# Altium project LM-CT-Full-Feedback-001.PrjPcb
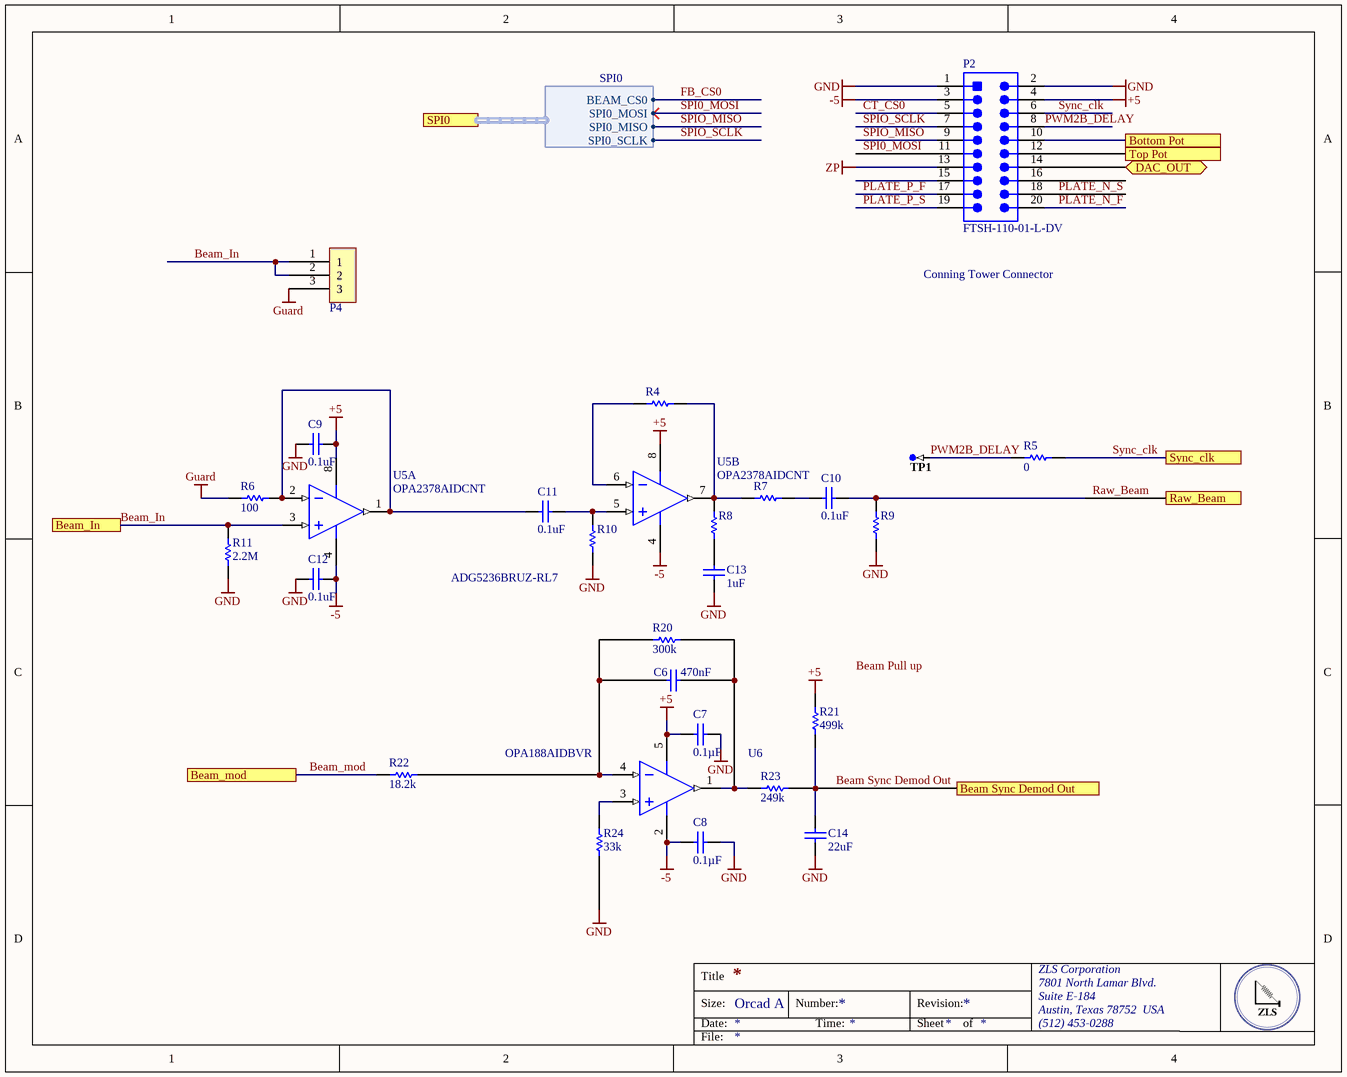
[diagram p0: Synch_Demod.SchDoc]
4 sheets, 79 parts. Net scope: flat (ports and power ports of the same name join across sheets).
Board file: LM-CT-001.PcbDoc
Sheets:
  Synch_Demod.SchDoc
  ADC.SchDoc
  Sense_Plates.SchDoc
  ZP_Force_Plates.SchDoc

## Sheet Synch_Demod.SchDoc
size OrCAD A

### Parts
C6  470nF  [CAPC0805(2012)75_L]
C7  Capacitance: 0.1µF  [CAPC0805(2012)145_N]  (hidden comment: CAP CER 0.1UF 25V X7R 0805)
C8  Capacitance: 0.1µF  [CAPC0805(2012)145_N]  (hidden comment: CAP CER 0.1UF 25V X7R 0805)
C9  0.1uF  [CAPC0402(1005)60_L]
C10  0.1uF  [CAPC0402(1005)60_L]
C11  0.1uF  [CAPC0402(1005)60_L]
C12  0.1uF  [CAPC0402(1005)60_L]
C13  1uF  [CAPC0402(1005)60_L]
C14  22uF  [CAPC0805(2012)75_L]
P2  FTSH-110-01-L-DV  [SMTC-FTSH-110-01-L-DV_V]
P4  Triax_Conn  [Triax_Conn]  (value not drawn)
R4  (no value)  [RESC0402(1005)_M]
R5  0  [RESC0402(1005)_M]
R6  100  [RESC0402(1005)_M]
R7  (no value)  [RESC0402(1005)_M]
R8  (no value)  [RESC0402(1005)_M]
R9  (no value)  [RESC0402(1005)_M]
R10  (no value)  [RESC0402(1005)_M]
R11  2.2M  [RESC0402(1005)_M]
R20  300k  [RESC0402(1005)_M]
R21  499k  [RESC0402(1005)_M]
R22  18.2k  [RESC0402(1005)_M]
R23  249k  [RESC0402(1005)_M]
R24  33k  [RESC0402(1005)_M]
TP1  TP-SM-C-100  [TP-SM-C-100]  (value not drawn)  (no BOM)
U5  OPA2378AIDCNT  [DCN0008A_M]  (parts A,B of 2)
U6  OPA188AIDBVR  [DBV0005A_M]

### Ports
Beam Sync Demod Out, Beam_In, Beam_mod, Bottom Pot, DAC_OUT, Raw_Beam, SPI0 (harness SPI0), Sync_clk, Top Pot

### Harnesses
SPI0: BEAM_CS0, SPI0_MOSI, SPI0_MISO, SPI0_SCLK

### Nets
+5: C7.1 C9.2 P2.4 R21.1 U5.8(V+) U6.5(V+)
-5: C8.1 C12.2 P2.3 U5.4(V-) U6.2(V-)
GND: C7.2 C8.2 C9.1 C12.1 C13.1 C14.1 P2.1 P2.2 R9.2 R10.2 R11.1 R24.2
Guard: P4.3 R6.2
ZP: P2.13
Beam Sync Demod Out: C14.2 R21.2 R23.2 ; port Beam Sync Demod Out
Beam_In: P4.1 P4.2 R11.2 U5.3(IN_A+) ; port Beam_In
Beam_mod: R22.1 ; port Beam_mod
CT_CS0: P2.5
DAC_OUT: P2.14 ; port DAC_OUT
PLATE_N_F: P2.20
PLATE_N_S: P2.18
PLATE_P_F: P2.17
PLATE_P_S: P2.19
PWM2B_DELAY: P2.8 R5.1 TP1.1
Raw_Beam: C10.2 R9.1 ; port Raw_Beam
SPI0_MOSI: P2.11 ; port SPI0.SPI0_MOSI
SPIO_MISO: P2.9 ; port SPI0.SPI0_MISO  [project net SPI0_MISO]
SPIO_SCLK: P2.7 ; port SPI0.SPI0_SCLK  [project net SPI0_SCLK]
Sync_clk: P2.6 R5.2 ; port Sync_clk
NetC6_1: C6.1 R20.1 R22.2 U6.4(IN-)
NetC6_2: C6.2 R20.2 R23.1 U6.1(OUT)
NetC10_1: C10.1 R7.1
NetC11_1: C11.1 R6.1 U5.1(OUT_A) U5.2(IN_A-)
NetC11_2: C11.2 R10.1 U5.5(IN_B+)
NetC13_2: C13.2 R8.2
NetP2_10: P2.10 ; port Bottom Pot
NetP2_12: P2.12 ; port Top Pot
NetR4_1: R4.1 R7.2 R8.1 U5.7(OUT_B)
NetR4_2: R4.2 U5.6(IN_B-)
NetR24_1: R24.1 U6.3(IN+)

Not connected (* = marked no-connect by the designer): P2 15 16

### Notes on the sheet
- Conning Tower Connector
- ADG5236BRUZ-RL7
- Labels drawn without touching a wire or pin: Beam Pull up
- Title
- Size:
- Date:
- Orcad A
- Number:
- Time:
- Revision:
- Sheet
- of
- ZLS Corporation
- 7801 North Lamar Blvd.
- Suite E-184
- Austin, Texas 78752  USA
- (512) 453-0288
- File:

### Library data of the parts
C6 = CMP-1036-02117-1: CAP CER 0.47UF 25V X7R 0805; Manufacturer: Murata Electronics North America; Manufacturer Part Number: GRM219R71E474KA88D; Tolerance: ±10%; Supplier 1: Digi-Key; Supplier Part Number 1: 490-11584-1-ND; RoHS: RoHS Compliant; Category: Capacitors; Stock 1: 410; Pricing 1: 1=0.38, 10=0.262, 100=0.1573, 500=0.118, 1000=0.09964 (USD); Packaging: Cut Tape (CT); Part Status: Active; Voltage - Rated: 25V; Temperature Coefficient: X7R; Operating Temperature: -55°C ~ 125°C; Features: -; Ratings: -; Applications: General Purpose; Mounting Type: Surface Mount, MLCC; Package / Case: 0805 (2012 Metric); Size / Dimension: 0.079" L x 0.049" W (2.00mm x 1.25mm); Height - Seated (Max): -; Thickness (Max): 0.037" (0.95mm); Lead Spacing: -; Lead Style: -; ComponentLink1URL: https://www.murata.com/~/media/webrenewal/support/library/catalog/products/capacitor/mlcc/c02e.ashx?la=en-us; ComponentLink1Description: https://www.murata.com/~/media/webrenewal/support/library/catalog/products/capacitor/mlcc/c02e.ashx?la=en-us
C7 C8 = CMP-1036-04795-1: Manufacturer: Murata Electronics North America; Manufacturer Part Number: GRM21BR71E104KA01L; Tolerance: ±10%; Supplier 1: Digi-Key; Supplier Part Number 1: 490-1673-6-ND; RoHS: RoHS Compliant; Category: Capacitors; Stock 1: 891652; Pricing 1: 1=0.2, 10=0.145, 100=0.0683, 500=0.04788, 1000=0.03964 (USD); Packaging: Digi-Reel®; Part Status: Active; Voltage - Rated: 25V; Temperature Coefficient: X7R; Operating Temperature: -55°C ~ 125°C; Features: -; Ratings: -; Applications: General Purpose; Mounting Type: Surface Mount, MLCC; Package / Case: 0805 (2012 Metric); Size / Dimension: 0.079" L x 0.049" W (2.00mm x 1.25mm); Height - Seated (Max): -; Thickness (Max): 0.053" (1.35mm); Lead Spacing: -; Lead Style: -; ComponentLink1URL: http://www.murata.com/~/media/webrenewal/support/library/catalog/products/capacitor/mlcc/c02e.ashx; ComponentLink1Description: http://www.murata.com/~/media/webrenewal/support/library/catalog/products/capacitor/mlcc/c02e.ashx
C9-C13 = CMP-1034-00252-1: CAP CER 0.1UF 10V X7R 0402; Manufacturer: Murata Electronics North America; Manufacturer Part Number: GRM155R71A104KA01D; Tolerance: ±10%; Supplier 1: Digi-Key; Supplier Part Number 1: 490-6321-1-ND; RoHS: RoHS Compliant; Category: Capacitors; Stock 1: 2920395; Pricing 1: 1=0.1, 10=0.014, 100=0.0063, 500=0.00446, 1000=0.00351, 2500=0.00319, 5000=0.00293 (USD); Packaging: Cut Tape (CT); Part Status: Active; Voltage - Rated: 10V; Temperature Coefficient: X7R; Operating Temperature: -55°C ~ 125°C; Features: -; Ratings: -; Applications: General Purpose; Mounting Type: Surface Mount, MLCC; Package / Case: 0402 (1005 Metric); Size / Dimension: 0.039" L x 0.020" W (1.00mm x 0.50mm); Height - Seated (Max): -; Thickness (Max): 0.022" (0.55mm); Lead Spacing: -; ComponentLink1URL: http://www.murata.com/~/media/webrenewal/support/library/catalog/products/capacitor/mlcc/c02e.ashx?la=en-us; ComponentLink1Description: http://www.murata.com/~/media/webrenewal/support/library/catalog/products/capacitor/mlcc/c02e.ashx?la=en-us
C14 = CMP-1036-02117-1: CAP CER 22UF 25V X5R 0805; Manufacturer: Murata Electronics North America; Manufacturer Part Number: GRM21BR61E226ME44L; Tolerance: ±20%; Notification: Current market demand for these product types have resulted in fluctuating and extending lead times. Lead times may differ.; Supplier 1: Digi-Key; Supplier Part Number 1: 490-10749-1-ND; RoHS: RoHS Compliant; Category: Capacitors; Stock 1: 2004; Pricing 1: 1=0.57, 10=0.404, 100=0.2663, 500=0.19722, 1000=0.16764 (USD); Packaging: Cut Tape (CT); Part Status: Active; Voltage - Rated: 25V; Temperature Coefficient: X5R; Operating Temperature: -55°C ~ 85°C; Features: -; Ratings: -; Applications: General Purpose; Mounting Type: Surface Mount, MLCC; Package / Case: 0805 (2012 Metric); Size / Dimension: 0.079" L x 0.049" W (2.00mm x 1.25mm); Height - Seated (Max): -; Thickness (Max): 0.057" (1.45mm); Lead Spacing: -; Lead Style: -; ComponentLink1URL: http://search.murata.co.jp/Ceramy/image/img/A01X/G101/ENG/GRM21BR61E226ME44-01.pdf; ComponentLink1Description: http://search.murata.co.jp/Ceramy/image/img/A01X/G101/ENG/GRM21BR61E226ME44-01.pdf
P2 = CMP-2000-06294-2: Male Header, Pitch 1.27 mm, 2 x 10 Position, Height 6.1 mm, -55 to 125 degC, RoHS, Tube; Manufacturer: Samtec; Online Catalog: FTSHSeries; Number of Positions Loaded: All; Connector Type: Header,Unshrouded; Product Training Modules: Board-to-BoardConnectors; Featured Product: Board-To-BoardInterconnectSystems; Other Names: SAM1161-10; EDA / CAD Models: DownloadfromAcceleratedDesigns; Number of Positions: 20; Catalog Drawings: FTSHSeriesFTSHSeriesSMTSide; Package Reference: FTSH-110-01-L-DV; Family: RectangularConnectors-Headers,MalePins; Mounting Technology: SurfaceMount; Contact Type: MalePin; Manufacturer URL: http://www.samtec.com/; Package URL: http://suddendocs.samtec.com/prints/ftsh-1xx-xx-xxx-dv-xxx-xxx-mkt.pdf; Package Description: Male Header, Pitch 1.27 mm, 2 x 10 Position, Height 6.1 mm; Packaging: Bulk; Termination: Solder; Category: Connectors,Interconnects; Fastening Type: -; Datasheet Version: F-215 , 02/2016; Contact Finish Thickness: 10µin(0.25µm); Number of Rows: 2; Datasheet URL: http://suddendocs.samtec.com/catalog_english/ftsh_smt.pdf; Mounting Type: SurfaceMount; Series: FTSH; Features: -; Contact Finish: Gold; Standard Package: 1; Color: Black
R4-R11 R20-R24 = CMP-1011-00463-1
TP1 = CMP-0484-00002-2: Test Point, Surface Mount, Circular, Pad Diameter 1 mm; Manufacturer: No Vendor; PartNumber: TP-SM-C-100
U5 = CMP-0272-01124-3: Low-Noise, 900 kHz, RRIO, Precision Operational Amplifier, Zero-Drift Series, 2.2 to 5.5 V, -40 to 125 degC, 8-pin SOP (DCN8), Green (RoHS & no Sb/Br); Manufacturer: Texas Instruments; Number of Channels: 2; Offset Drift(Typ)(uV/C): 0.25; Total Supply Voltage(Min)(+5V is 5, +/-5V is 10): 2.2; Vn at 1kHz(Typ)(nV/rtHz): 20; Iq per channel(Max)(mA): 0.15; Total Supply Voltage(Max)(+5V is 5, +/-5V is 10): 5.5; Sub Family: Low Offset Voltage Amplifier (<=500uV), Low Power Amp (<=500uA), Low Supply Voltage Amplifier (<=2.7V), Precision Amplifier, Zero Drift Precision Amplifier; IIB(Max)(pA): 550; Vio (25C)(Max)(mV): 0.07; CMRR(Min)(dB): 100; Slew Rate(Typ)(V/us): 0.4; PartNumber: OPA2378AIDCNT; DatasheetVersion: SBOS417D; ComponentLink2Description: Datasheet; ComponentLink3URL: http://www.ti.com/lit/ml/mpds099c/mpds099c.pdf; ComponentLink2URL: http://www.ti.com/general/docs/lit/getliterature.tsp?genericPartNumber=OPA2378&fileType=pdf; PackageReference: DCN0008A; PackageDescription: 8-Pin Plastic Small Outline, Body 1.6 x 2.9 mm, Pitch 0.65 mm; Code_JEDEC: MO-178; PackageVersion: 4202106/D, 11/2009; ComponentLink3Description: Package Specification; Eco-Plan: Green (RoHS & no Sb/Br); ComponentLink1Description: Manufacturer URL; Mounting Technology: Surface Mount; ComponentLink1URL: http://www.ti.com/; PartId: 1
U6 = CMP-0809-00005-2: Precision, Low Noise, Rail-to-Rail Output, Zero-Drift Operational Amplifier, 4 to 36 V, -40 to 125 degC, 5-pin SOT23 (DBV5), Green (RoHS & no Sb/Br); Manufacturer: Texas Instruments; Total Supply Voltage(Min)(+5V is 5, +/-5V is 10): 4; Offset Drift(Typ)(uV/C): 0.03; Rating: Catalog; SubFamily: Zero Drift Precision Amplifier; GBW(Typ)(MHz): 2; Slew Rate(Typ)(V/us): 0.8; Number of Channels: 1; CMRR(Min)(dB): 120; Iq per channel(Max)(mA): 0.51; Total Supply Voltage(Max)(+5V is 5, +/-5V is 10): 36; PartNumber: OPA188AIDBVR; ComponentLink2Description: Datasheet; ComponentLink2URL: http://www.ti.com/lit/ds/symlink/opa188.pdf; ComponentLink1Description: Manufacturer URL; Mounting Technology: Surface Mount; Eco-Plan: Green (RoHS & no Sb/Br); ComponentLink1URL: http://www.ti.com/; PackageVersion: 4073253-4/K, 03/2006; DatasheetVersion: SBOS642A; ComponentLink3Description: Package Specification; PackageReference: DBV0005A; ComponentLink3URL: http://www.ti.com/litv/pdf/mpds018i; PackageDescription: 5-Pin Plastic Small Outline, Body 1.6 x 2.9 mm, Pitch 0.95 mm; Code_JEDEC: MO-178

## Sheet ADC.SchDoc
size OrCAD A
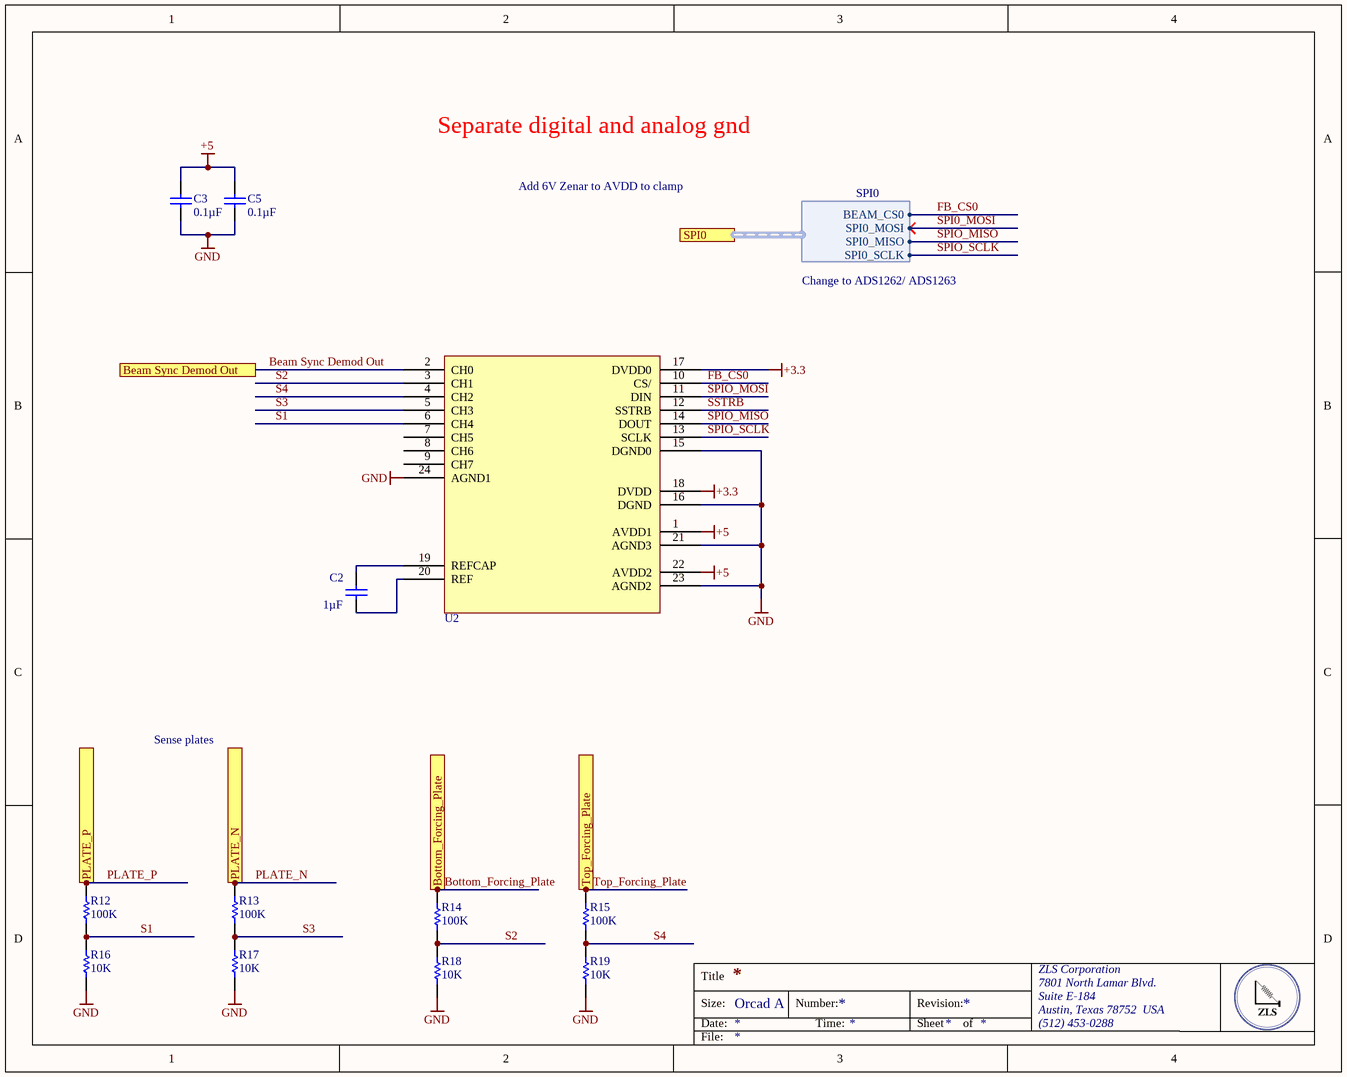
[diagram p1: ADC.SchDoc]

### Parts
C2  Capacitance: 1µF  [CAPC0805(2012)145_N]  (hidden comment: CAP CER 0.1UF 25V X7R 0805)
C3  Capacitance: 0.1µF  [CAPC0805(2012)145_N]  (hidden comment: CAP CER 0.1UF 25V X7R 0805)
C5  Capacitance: 0.1µF  [CAPC0805(2012)145_N]  (hidden comment: CAP CER 0.1UF 25V X7R 0805)
R12  100K  [RESC0402(1005)_M]
R13  100K  [RESC0402(1005)_M]
R14  100K  [RESC0402(1005)_M]
R15  100K  [RESC0402(1005)_M]
R16  10K  [RESC0402(1005)_M]
R17  10K  [RESC0402(1005)_M]
R18  10K  [RESC0402(1005)_M]
R19  10K  [RESC0402(1005)_M]
U2  MAX1300  [MAX1300]  (value not drawn)

### Ports
Beam Sync Demod Out, Bottom_Forcing_Plate, PLATE_N, PLATE_P, SPI0 (harness SPI0), Top_Forcing_Plate

### Harnesses
SPI0: BEAM_CS0, SPI0_MOSI, SPI0_MISO, SPI0_SCLK

### Nets
+3.3: U2.17(DVDD0) U2.18(DVDD)
+5: C3.2 C5.2 U2.1(AVDD1) U2.22(AVDD2)
GND: C3.1 C5.1 R16.1 R17.1 R18.1 R19.1 U2.15(DGND0) U2.16(DGND) U2.21(AGND3) U2.23(AGND2) U2.24(AGND1)
Beam Sync Demod Out: U2.2(CH0) ; port Beam Sync Demod Out
Bottom_Forcing_Plate: R14.2 ; port Bottom_Forcing_Plate  [project net Bottom Forcing Plate Force]
FB_CS0: U2.10(CS/) ; port SPI0.BEAM_CS0
PLATE_N: R13.2 ; port PLATE_N
PLATE_P: R12.2 ; port PLATE_P
S1: R12.1 R16.2 U2.6(CH4)
S2: R14.1 R18.2 U2.3(CH1)
S3: R13.1 R17.2 U2.5(CH3)
S4: R15.1 R19.2 U2.4(CH2)
SPIO_MISO: U2.14(DOUT) ; port SPI0.SPI0_MISO  [project net SPI0_MISO]
SPIO_MOSI: U2.11(DIN)
SPIO_SCLK: U2.13(SCLK) ; port SPI0.SPI0_SCLK  [project net SPI0_SCLK]
SSTRB: U2.12(SSTRB)
Top_Forcing_Plate: R15.2 ; port Top_Forcing_Plate  [project net Top Forcing Plate Sense]
NetC2_1: C2.1 U2.19(REFCAP)
NetC2_2: C2.2 U2.20(REF)

Not connected (* = marked no-connect by the designer): U2 7(CH5) 8(CH6) 9(CH7)

### Notes on the sheet
- Separate digital and analog gnd
- Add 6V Zenar to AVDD to clamp
- Change to ADS1262/ ADS1263
- Sense plates
- Title
- Size:
- Date:
- Orcad A
- Number:
- Time:
- Revision:
- Sheet
- of
- ZLS Corporation
- 7801 North Lamar Blvd.
- Suite E-184
- Austin, Texas 78752  USA
- (512) 453-0288
- File:

### Library data of the parts
C2 C3 C5 = CMP-1036-04795-1: as C7 on sheet Synch_Demod; Supplier 1: Digi-Key; Supplier Part Number 1: 490-1673-6-ND; RoHS: RoHS Compliant; Category: Capacitors; Stock 1: 891652; Pricing 1: 1=0.2, 10=0.145, 100=0.0683, 500=0.04788, 1000=0.03964 (USD); Packaging: Digi-Reel®; Part Status: Active; Voltage - Rated: 25V; Temperature Coefficient: X7R; Operating Temperature: -55°C ~ 125°C; Features: -; Ratings: -; Applications: General Purpose; Mounting Type: Surface Mount, MLCC; Package / Case: 0805 (2012 Metric); Size / Dimension: 0.079" L x 0.049" W (2.00mm x 1.25mm); Height - Seated (Max): -; Thickness (Max): 0.053" (1.35mm); Lead Spacing: -; Lead Style: -; ComponentLink1URL: http://www.murata.com/~/media/webrenewal/support/library/catalog/products/capacitor/mlcc/c02e.ashx; ComponentLink1Description: http://www.murata.com/~/media/webrenewal/support/library/catalog/products/capacitor/mlcc/c02e.ashx
R12-R19 = CMP-1011-00463-1

## Sheet Sense_Plates.SchDoc
size Tabloid; Organization: Altium Limited; Address1: L3, 12a Rodborough Rd; Address2: Frenchs Forest; Address3: NSW; Address4: Australia 2086
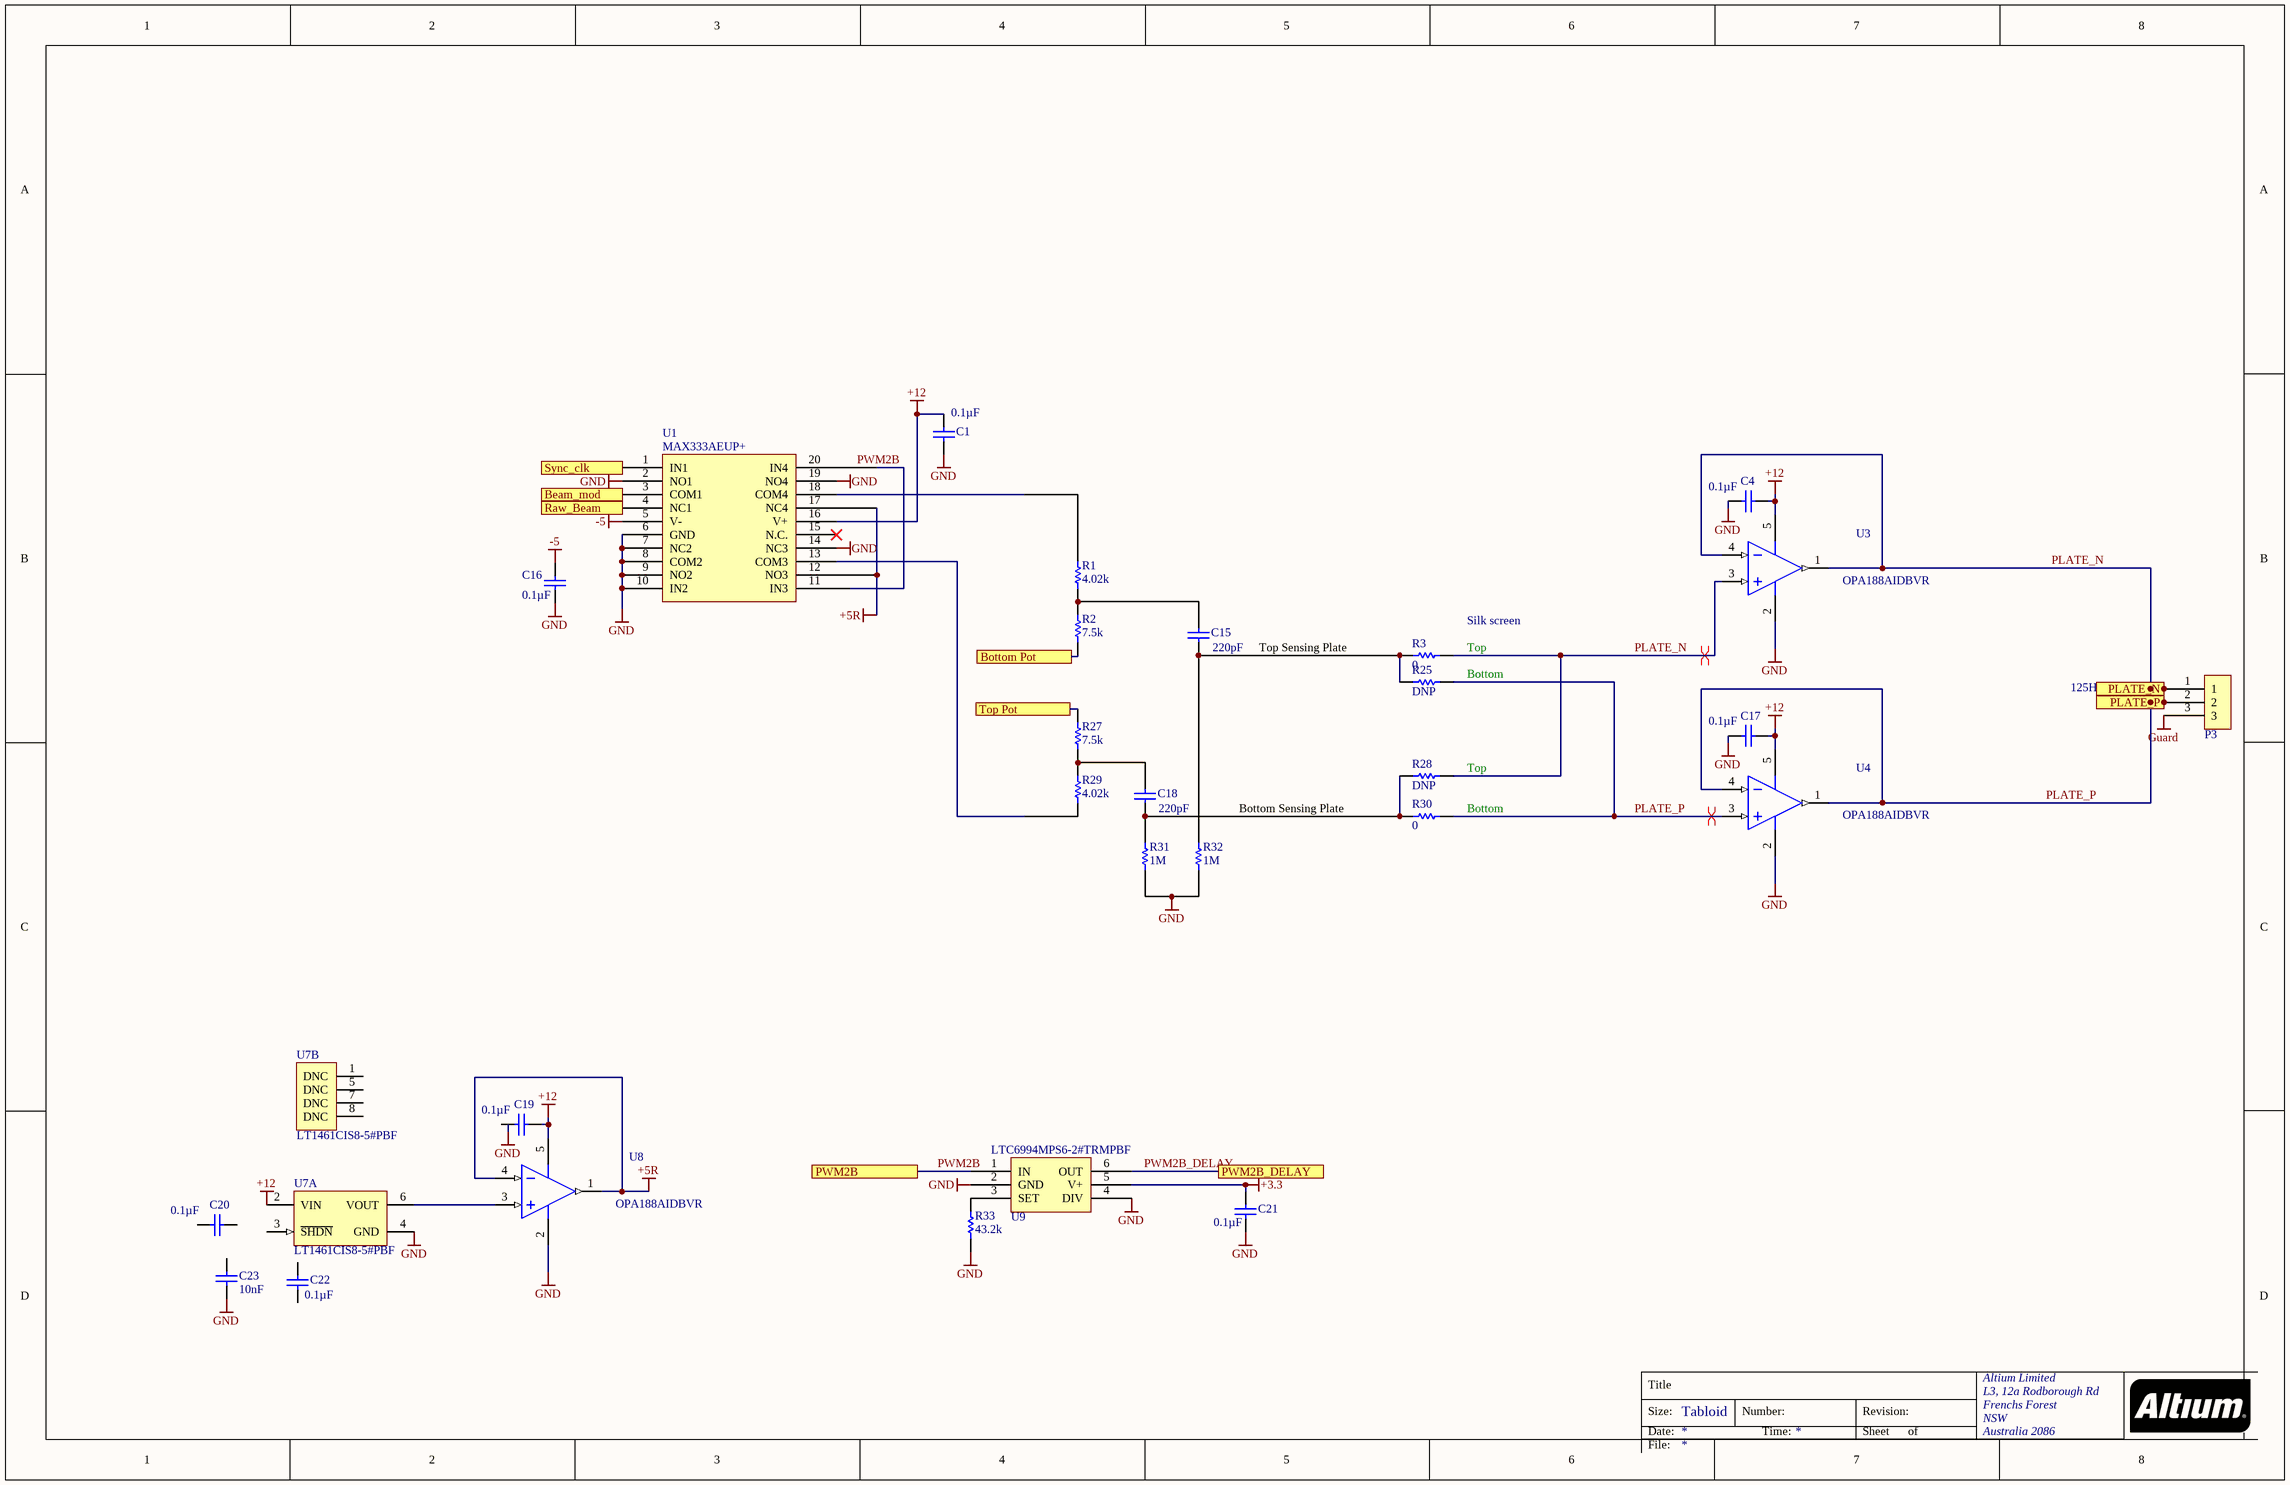
[diagram p2: Sense_Plates.SchDoc]

### Parts
C1  Capacitance: 0.1µF  [CAPC0805(2012)145_N]  (hidden comment: CAP CER 0.1UF 25V X7R 0805)
C4  Capacitance: 0.1µF  [CAPC0805(2012)145_N]  (hidden comment: CAP CER 0.1UF 25V X7R 0805)
C15  Capacitance: 220pF  [CAPC0805(2012)155_L]  (hidden comment: CAP CER 1UF 25V X7R 0805)
C16  Capacitance: 0.1µF  [CAPC0805(2012)145_N]  (hidden comment: CAP CER 0.1UF 25V X7R 0805)
C17  Capacitance: 0.1µF  [CAPC0805(2012)145_N]  (hidden comment: CAP CER 0.1UF 25V X7R 0805)
C18  Capacitance: 220pF  [CAPC0805(2012)155_L]  (hidden comment: CAP CER 1UF 25V X7R 0805)
C19  Capacitance: 0.1µF  [CAPC0805(2012)145_N]  (hidden comment: CAP CER 0.1UF 25V X7R 0805)
C20  Capacitance: 0.1µF  [CAPC0805(2012)145_N]  (hidden comment: CAP CER 0.1UF 25V X7R 0805)
C21  Capacitance: 0.1µF  [CAPC0805(2012)145_N]  (hidden comment: CAP CER 0.1UF 25V X7R 0805)
C22  Capacitance: 0.1µF  [CAPC0805(2012)145_N]  (hidden comment: CAP CER 0.1UF 25V X7R 0805)
C23  Capacitance: 10nF  [CAPC0805(2012)145_N]  (hidden comment: Multilayer Ceramic Capacitors MLCC - SMD/SMT 0.01uF 50volts 10% X7R)
P3  Triax_Conn  [Triax_Conn]  (value not drawn)
R1  4.02k  [RESC0402(1005)_M]
R2  7.5k  [RESC0402(1005)_M]
R3  0  [RESC0402(1005)_M]
R25  DNP  [RESC0402(1005)_M]
R27  7.5k  [RESC0402(1005)_M]
R28  DNP  [RESC0402(1005)_M]
R29  4.02k  [RESC0402(1005)_M]
R30  0  [RESC0402(1005)_M]
R31  1M  [RESC0402(1005)_M]
R32  1M  [RESC0402(1005)_M]
R33  43.2k  [RESC0402(1005)_M]
U1  MAX333AEUP+  [TSOP65P640X90-20N]
U3  OPA188AIDBVR  [DBV0005A_M]
U4  OPA188AIDBVR  [DBV0005A_M]
U7  LT1461CIS8-5#PBF  [LT-S8-8_L]  (parts A,B of 2)
U8  OPA188AIDBVR  [DBV0005A_M]
U9  LTC6994MPS6-2#TRMPBF  [LTC6994MPS6-2#TRMPBF]

### Ports
Beam_mod, Bottom Pot, PLATE_N, PLATE_P, PWM2B, PWM2B_DELAY, Raw_Beam, Sync_clk, Top Pot

### Nets
+3.3: C21.1 U9.5(V+)
+5R: U1.12(NO3) U1.17(NC4) U8.1(OUT) U8.4(IN-)
+12: C1.1 C4.2 C17.2 C19.2 U1.16(V+) U3.5(V+) U4.5(V+) U7.2(VIN) U8.5(V+)
-5: C16.1 U1.5(V-)
GND: C1.2 C4.1 C16.2 C17.1 C21.2 C23.2 R31.1 R32.1 R33.1 U1.2(NO1) U1.6(GND) U1.7(NC2) U1.8(COM2) U1.9(NO2) U1.10(IN2) U1.14(NC3) U1.19(NO4) U3.2(V-) U4.2(V-) U7.4(GND) U8.2(V-) U9.2(GND) U9.4(DIV)
Guard: P3.3
Beam_mod: U1.3(COM1) ; port Beam_mod
PLATE_N: P3.1 R3.1 R28.1 U3.1(OUT) U3.3(IN+) U3.4(IN-) ; port PLATE_N
PLATE_P: P3.2 R25.1 R30.1 U4.1(OUT) U4.3(IN+) U4.4(IN-) ; port PLATE_P
PWM2B: U1.11(IN3) U1.20(IN4) U9.1(IN) ; port PWM2B
PWM2B_DELAY: U9.6(OUT) ; port PWM2B_DELAY
Raw_Beam: U1.4(NC1) ; port Raw_Beam
Sync_clk: U1.1(IN1) ; port Sync_clk
NetC15_1: C15.1 R3.2 R25.2 R32.2
NetC15_2: C15.2 R1.1 R2.2
NetC18_1: C18.1 R28.2 R30.2 R31.2
NetC18_2: C18.2 R27.1 R29.2
NetP2_10: R2.1 ; port Bottom Pot
NetP2_12: R27.2 ; port Top Pot
NetR1_2: R1.2 U1.18(COM4)
NetR29_1: R29.1 U1.13(COM3)
NetR33_2: R33.2 U9.3(SET)
NetU7_6: U7.6(VOUT) U8.3(IN+)

Not connected (* = marked no-connect by the designer): C19 1; C20 1 2; C22 1 2; C23 1; U1 15(N.C.)*; U7 1(DNC) 3(~{SHDN}) 5(DNC) 7(DNC) 8(DNC)

### Layout directives
differential pair: PLATE_N, PLATE_P

### Notes on the sheet
- Silk screen
- Top Sensing Plate
- Top
- Bottom
- 125Hz
- Bottom Sensing Plate
- (near R28) Top
- Title
- Size:
- Date:
- Tabloid
- Number:
- Time:
- Revision:
- Sheet
- of
- File:

### Library data of the parts
C1 C4 C16 C17 C19-C22 = CMP-1036-04795-1: as C7 on sheet Synch_Demod; Supplier 1: Digi-Key; Supplier Part Number 1: 490-1673-6-ND; RoHS: RoHS Compliant; Category: Capacitors; Stock 1: 891652; Pricing 1: 1=0.2, 10=0.145, 100=0.0683, 500=0.04788, 1000=0.03964 (USD); Packaging: Digi-Reel®; Part Status: Active; Voltage - Rated: 25V; Temperature Coefficient: X7R; Operating Temperature: -55°C ~ 125°C; Features: -; Ratings: -; Applications: General Purpose; Mounting Type: Surface Mount, MLCC; Package / Case: 0805 (2012 Metric); Size / Dimension: 0.079" L x 0.049" W (2.00mm x 1.25mm); Height - Seated (Max): -; Thickness (Max): 0.053" (1.35mm); Lead Spacing: -; Lead Style: -; ComponentLink1URL: http://www.murata.com/~/media/webrenewal/support/library/catalog/products/capacitor/mlcc/c02e.ashx; ComponentLink1Description: http://www.murata.com/~/media/webrenewal/support/library/catalog/products/capacitor/mlcc/c02e.ashx
C15 C18 = CMP-1036-04882-1: Manufacturer: Murata Electronics North America; Manufacturer Part Number: GRM21BR71E105KA99L; Tolerance: ±10%; Supplier 1: Digi-Key; Supplier Part Number 1: 490-6484-6-ND; RoHS: RoHS Compliant; Category: Capacitors; Stock 1: 295074; Pricing 1: 1=0.14, 10=0.099, 100=0.0468, 500=0.0328, 1000=0.02715 (USD); Packaging: Digi-Reel®; Part Status: Active; Voltage - Rated: 25V; Temperature Coefficient: X7R; Operating Temperature: -55°C ~ 125°C; Features: -; Ratings: -; Applications: General Purpose; Mounting Type: Surface Mount, MLCC; Package / Case: 0805 (2012 Metric); Size / Dimension: 0.079" L x 0.049" W (2.00mm x 1.25mm); Height - Seated (Max): -; Thickness (Max): 0.053" (1.35mm); Lead Spacing: -; Lead Style: -; ComponentLink1URL: http://www.murata.com/~/media/webrenewal/support/library/catalog/products/capacitor/mlcc/c02e.ashx; ComponentLink1Description: http://www.murata.com/~/media/webrenewal/support/library/catalog/products/capacitor/mlcc/c02e.ashx
C23 = CMP-1036-04795-1: Manufacturer: Kemet; Manufacturer Part Number: C0805C103K5RACAUTO; Voltage Rating: 50V; Supplier 1: Digi-Key; Supplier Part Number 1: 399-6924-1-ND; Stock 1: 63236; Pricing 1: 1=0.12, 10=0.087, 100=0.041, 500=0.0287, 1000=0.0238 (USD); Mount: Surface Mount; Case/Package: 0805; Case Code (Metric): 2012; Case Code (Imperial): 0805; Dielectric Material: Ceramic; Contact Plating: Tin; Min Operating Temperature: -55°C; Max Operating Temperature: 125°C; Tolerance: 10%; Packaging: Tape and Reel; Package Quantity: 1; Voltage Rating (DC): 50V; Dielectric: X7R; Termination: SMD/SMT; Length: 2mm; Height: 0.78mm; Width: 0.049inch; Thickness: 0.035inch; Depth: 1.25mm; Radiation Hardening: No; REACH SVHC: No SVHC; ComponentLink1URL: https://datasheet.ciiva.com/22700/1693454-22700519.pdf; ComponentLink1Description: https://datasheet.ciiva.com/22700/1693454-22700519.pdf; ComponentLink2URL: https://datasheet.ciiva.com/7842/1693454-7842175.pdf; ComponentLink2Description: https://datasheet.ciiva.com/7842/1693454-7842175.pdf
R1-R3 R25 R27-R33 = CMP-1011-00463-1
U1 = MAX333CWP+: IC SWITCH QUAD SPDT 20TSSOP; Manufacturer: Maxim Integrated; Multiplexer/Demultiplexer Circuit: 2:1; On-State Resistance (Max): 45 Ohm; Channel-to-Channel Matching (&Delta;Ron): 2 Ohm (Max); Voltage - Supply, Single (V+): 10 V ~ 30 V; Voltage - Supply, Dual (V±): ±4.5 V ~ 20 V; Switch Time (Ton, Toff) (Max): 175ns, 145ns; Charge Injection: 2pC; Channel Capacitance (CS(off), CD(off)): 5pF; Current - Leakage (IS(off)) (Max): 250pA; Crosstalk: -78dB @ 1MHz; Supplier 1: Digi-Key; Supplier Part Number 1: MAX333AEUP+-ND; Manufacturer Part Number: MAX333AEUP+; RoHS: RoHS Compliant; Category: Integrated Circuits (ICs); Stock 1: 1328; Pricing 1: 1=6.77, 10=6.432, 25=6, 50=5.8942 (USD); Packaging: Tube; Part Status: Active; Switch Circuit: SPDT; -3db Bandwidth: -; Operating Temperature: -40°C ~ 85°C (TA); Package / Case: 20-TSSOP (0.173", 4.40mm Width); Supplier Device Package: 20-TSSOP; Base Part Number: MAX333; ComponentLink1URL: https://pdfserv.maximintegrated.com/en/ds/MAX333A.pdf; ComponentLink1Description: https://pdfserv.maximintegrated.com/en/ds/MAX333A.pdf
U3 U4 U8 = CMP-0809-00005-2: as U6 on sheet Synch_Demod; PartNumber: OPA188AIDBVR; ComponentLink2Description: Datasheet; ComponentLink2URL: http://www.ti.com/lit/ds/symlink/opa188.pdf; ComponentLink1Description: Manufacturer URL; Mounting Technology: Surface Mount; Eco-Plan: Green (RoHS & no Sb/Br); ComponentLink1URL: http://www.ti.com/; PackageVersion: 4073253-4/K, 03/2006; DatasheetVersion: SBOS642A; ComponentLink3Description: Package Specification; PackageReference: DBV0005A; ComponentLink3URL: http://www.ti.com/litv/pdf/mpds018i; PackageDescription: 5-Pin Plastic Small Outline, Body 1.6 x 2.9 mm, Pitch 0.95 mm; Code_JEDEC: MO-178
U7 = CMP-2000-06607-1: Micropower Precision Low Dropout Voltage Reference, 5 V, -40 to 85 degC, 8-Pin SOIC, RoHS, Tube; Manufacturer: Linear Technology; Temperature Coefficient: 12ppm/°C; Product Training Modules: VoltageReferenceBasics; Voltage - Output: 5V; Voltage - Input: 5.5V~20V; Package Version: 0; Tolerance: ±0.08%; Current - Quiescent: 50µA; Number of Channels: 1; Current - Output: 100mA; Dynamic Catalog: Series,Fixed-LinearTechnology; Reference Type: Series,Precision; Current - Cathode: -; Standard Package: 100; Supplier Device Package: 8-SOIC; Packaging: Tube; Category: IntegratedCircuits(ICs); Package Reference: S8; Series: -; Family: PMIC-VoltageReference; Datasheet URL: http://cds.linear.com/docs/en/datasheet/1461fb.pdf; Package Description: 8-Pin Plastic Small Outline (Narrow .150 Inch), Body 4.9 x 3.9 mm, Pitch 1.27 mm; Mounting Type: SurfaceMount; Datasheet Version: Rev. B, 09/2015; Manufacturer URL: http://www.linear.com/; Mounting Technology: SurfaceMount; Operating Temperature: -40°C~85°C; Package URL: http://cds.linear.com/docs/Packaging/05081610_G_SO8.pdf; PartId: 1
U9 = LTC6994MPS6-2#TRMPBF: IC DELAY BLOCK 8TAP PROG TSOT23; Manufacturer: Linear Technology/Analog Devices; Manufacturer Part Number: LTC6994CS6-2#TRMPBF; Function: Programmable; Available Total Delays: 1µs ~ 33.6s; Voltage - Supply: 2.25 V ~ 5.5 V; Supplier 1: Digi-Key; Supplier Part Number 1: LTC6994CS6-2#TRMPBFCT-ND; RoHS: RoHS Compliant; Category: Integrated Circuits (ICs); Stock 1: 1401; Pricing 1: 1=3.42, 25=3.0496, 100=1.9217, 250=1.76156 (USD); Packaging: Cut Tape (CT); Part Status: Active; Delay to 1st Tap: -; Operating Temperature: 0°C ~ 70°C; Mounting Type: Surface Mount; Package / Case: SOT-23-6 Thin, TSOT-23-6; Supplier Device Package: TSOT-23-6; Base Part Number: LTC6994; ComponentLink1URL: http://www.linear.com/docs/29725; ComponentLink1Description: http://www.linear.com/docs/29725

## Sheet ZP_Force_Plates.SchDoc
size Tabloid; Organization: Altium Limited; Address1: L3, 12a Rodborough Rd; Address2: Frenchs Forest; Address3: NSW; Address4: Australia 2086
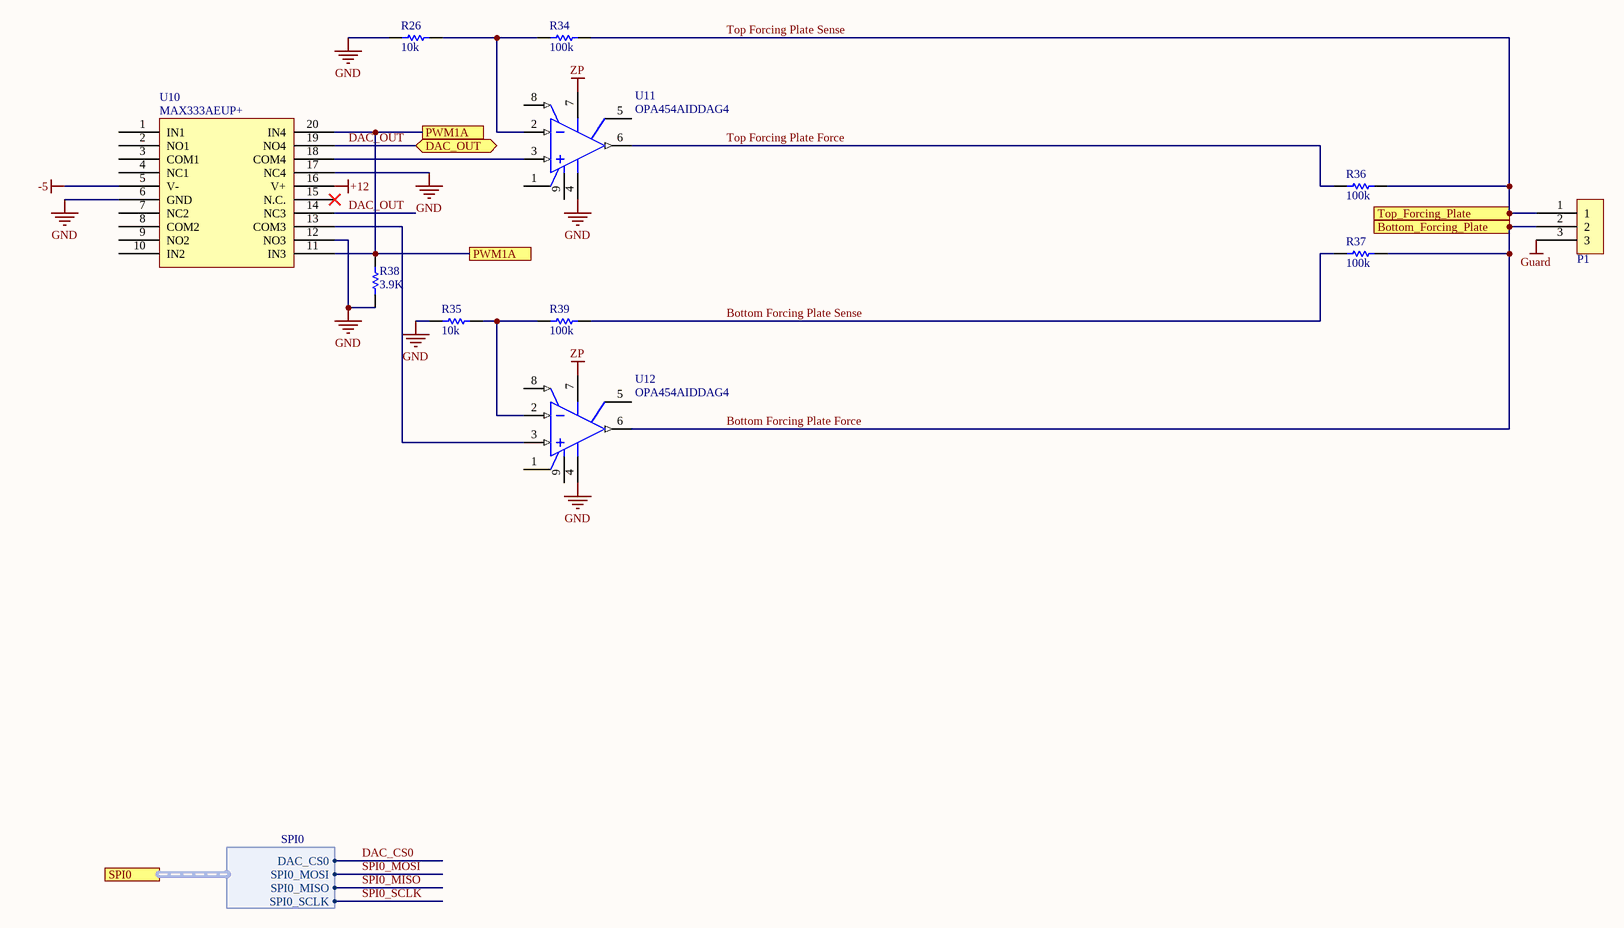
[diagram p3: ZP_Force_Plates.SchDoc]

### Parts
P1  Triax_Conn  [Triax_Conn]  (value not drawn)
R26  10k  [RESC0402(1005)_M]
R34  100k  [RESC0402(1005)_M]
R35  10k  [RESC0402(1005)_M]
R36  100k  [RESC0402(1005)_M]
R37  100k  [RESC0402(1005)_M]
R38  3.9K  [RESC0402(1005)_M]
R39  100k  [RESC0402(1005)_M]
U10  MAX333AEUP+  [TSOP65P640X90-20N]
U11  OPA454AIDDAG4  [TI-DDA8-2745X2245TP_N]
U12  OPA454AIDDAG4  [TI-DDA8-2745X2245TP_N]

### Ports
Bottom_Forcing_Plate, DAC_OUT, PWM1A, SPI0 (harness SPI0), Top_Forcing_Plate

### Harnesses
SPI0: DAC_CS0, SPI0_MOSI, SPI0_MISO, SPI0_SCLK

### Nets
+12: U10.16(V+)
-5: U10.5(V-)
GND: R26.1 R35.1 R38.1 U10.6(GND) U10.12(NO3) U10.17(NC4) U11.4(V-) U12.4(V-)
Guard: P1.3
ZP: U11.7(V+) U12.7(V+)
Bottom Forcing Plate Force: P1.2 R37.1 U12.6(OUT) ; port Bottom_Forcing_Plate
Bottom Forcing Plate Sense: R37.2 R39.2
DAC_CS0: port SPI0.DAC_CS0
DAC_OUT: U10.14(NC3) U10.19(NO4) ; port DAC_OUT
Top Forcing Plate Force: R36.2 U11.6(OUT)
Top Forcing Plate Sense: P1.1 R34.2 R36.1 ; port Top_Forcing_Plate
NetR26_2: R26.2 R34.1 U11.2(IN-)
NetR35_2: R35.2 R39.1 U12.2(IN-)
NetR38_2: R38.2 U10.11(IN3) U10.20(IN4) ; port PWM1A
NetU10_13: U10.13(COM3) U12.3(IN+)
NetU10_18: U10.18(COM4) U11.3(IN+)

Not connected (* = marked no-connect by the designer): U10 1(IN1) 2(NO1) 3(COM1) 4(NC1) 7(NC2) 8(COM2) 9(NO2) 10(IN2) 15(N.C.)*; U11 1(E/D_COM) 5(STATUS_FLAG) 8(E/D) 9(EP); U12 1(E/D_COM) 5(STATUS_FLAG) 8(E/D) 9(EP)

### Notes on the sheet
- Title
- Size:
- Date:
- Tabloid
- Number:
- Time:
- Revision:
- Sheet
- of
- File:

### Library data of the parts
R26 R34 R35 R38 R39 = CMP-1011-00463-1
R36 R37 = CMP-1011-00651-1
U10 = MAX333CWP+: as U1 on sheet Sense_Plates; Supplier 1: Digi-Key; Supplier Part Number 1: MAX333AEUP+-ND; Manufacturer Part Number: MAX333AEUP+; RoHS: RoHS Compliant; Category: Integrated Circuits (ICs); Stock 1: 1328; Pricing 1: 1=6.77, 10=6.432, 25=6, 50=5.8942 (USD); Packaging: Tube; Part Status: Active; Switch Circuit: SPDT; -3db Bandwidth: -; Operating Temperature: -40°C ~ 85°C (TA); Package / Case: 20-TSSOP (0.173", 4.40mm Width); Supplier Device Package: 20-TSSOP; Base Part Number: MAX333; ComponentLink1URL: https://pdfserv.maximintegrated.com/en/ds/MAX333A.pdf; ComponentLink1Description: https://pdfserv.maximintegrated.com/en/ds/MAX333A.pdf
U11 U12 = CMP-0017-00715-1: High Voltage (100V), High-Current (50mA) Operational Amplifier, G=1 Stable, 10 to 100 V, -55 to 125 degC, 8-pin SOP (DDA8), Green (RoHS & no Sb/Br); Manufacturer: Texas Instruments; Sub Family: General Purpose Amplifier, High Output Current Amplifier (>=50mA), High Supply Voltage Amplifier (>=30V), Precision Amplifier; Offset Drift(Typ)(uV/C): 1.6; Slew Rate(Typ)(V/us): 13; Number of Channels: 1; Total Supply Voltage(Max)(+5V is 5, +/-5V is 10): 100; Total Supply Voltage(Min)(+5V is 5, +/-5V is 10): 10; Vio (25C)(Max)(mV): 4; GBW(Typ)(MHz): 2.5; Vn at 1kHz(Typ)(nV/rtHz): 47; Rating: Catalog; ComponentLink1URL: http://www.ti.com/; PartNumber: OPA454AIDDAG4; ComponentLink1Description: Manufacturer URL; Eco-Plan: Green (RoHS & no Sb/Br); ComponentLink3URL: http://www.ti.com/litv/pdf/mpds092e; IIB(Max)(pA): 100; ComponentLink2URL: http://www.ti.com/lit/ds/symlink/opa454.pdf; ComponentLink3Description: Package Specification; DatasheetVersion: SBOS391A; Iq per channel(Max)(mA): 4; PackageVersion: 4202561/F, 12/2011; Code_JEDEC: MS-012; CMRR(Min)(dB): 100; PackageReference: DDA8-2745X2245TP; Mounting Technology: Surface Mount; ComponentLink2Description: Datasheet; PackageDescription: 8-Pin PowerPAD(TM) Plastic Small Outline, Body 3.9 x 4.9 mm, Pitch 1.27 mm

## Nets that join several sheets
+3.3: ADC (U2.17 U2.18), Sense_Plates (C21.1 U9.5)
+5: Synch_Demod (6 pins), ADC (C3.2 C5.2 U2.1 U2.22)
+12: Sense_Plates (9 pins), ZP_Force_Plates (U10.16)
-5: Synch_Demod (5 pins), Sense_Plates (C16.1 U1.5), ZP_Force_Plates (U10.5)
GND: Synch_Demod (12 pins), ADC (11 pins), Sense_Plates (23 pins), ZP_Force_Plates (8 pins)
Guard: Synch_Demod (P4.3 R6.2), Sense_Plates (P3.3), ZP_Force_Plates (P1.3)
ZP: Synch_Demod (P2.13), ZP_Force_Plates (U11.7 U12.7)
Beam Sync Demod Out: Synch_Demod (C14.2 R21.2 R23.2), ADC (U2.2)
Beam_mod: Synch_Demod (R22.1), Sense_Plates (U1.3)
Bottom Forcing Plate Force: ADC (R14.2), ZP_Force_Plates (P1.2 R37.1 U12.6)
DAC_OUT: Synch_Demod (P2.14), ZP_Force_Plates (U10.14 U10.19)
NetP2_10: Synch_Demod (P2.10), Sense_Plates (R2.1)
NetP2_12: Synch_Demod (P2.12), Sense_Plates (R27.2)
PLATE_N: ADC (R13.2), Sense_Plates (6 pins)
PLATE_P: ADC (R12.2), Sense_Plates (6 pins)
Raw_Beam: Synch_Demod (C10.2 R9.1), Sense_Plates (U1.4)
SPI0_MISO: Synch_Demod (P2.9), ADC (U2.14)
SPI0_SCLK: Synch_Demod (P2.7), ADC (U2.13)
Sync_clk: Synch_Demod (P2.6 R5.2), Sense_Plates (U1.1)
Top Forcing Plate Sense: ADC (R15.2), ZP_Force_Plates (P1.1 R34.2 R36.1)